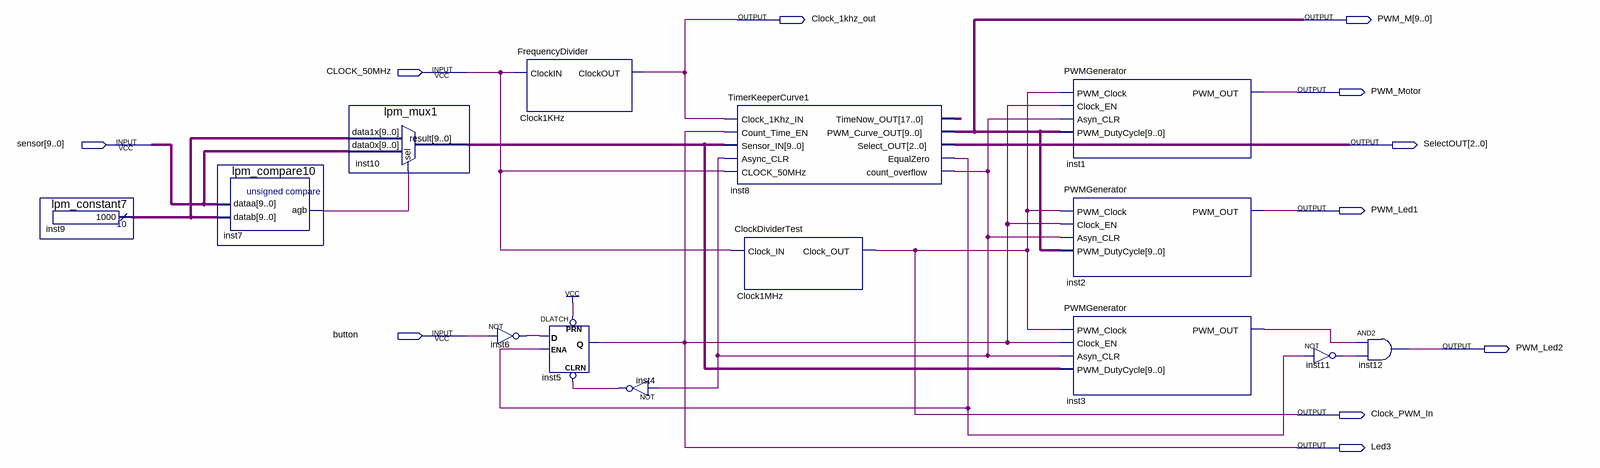
[diagram p0: schematic sheet]
// Quartus schematic MainDesign.bdf as structural Verilog: 14 symbols, 11 pins
module MainDesign (
  input  CLOCK_50MHz,
  input  [9:0] sensor,
  input  button,
  output Clock_1khz_out,
  output [9:0] PWM_M,
  output PWM_Motor,
  output [2:0] SelectOUT,
  output PWM_Led1,
  output PWM_Led2,
  output Clock_PWM_In,
  output Led3
);

  wire inst3_pwm_out, inst4_out, inst6_out, inst7_agb, inst8_count_overflow, inst8_equalzero, inst11_out;
  wire [9:0] inst9_result, inst10_result;
  wire [17:0] inst8_timenow_out;

  lpm_constant7 inst9 (.result(inst9_result));
  lpm_compare10 inst7 (.dataa(sensor), .datab(inst9_result), .agb(inst7_agb));
  lpm_mux1 inst10 (.data1x(inst9_result), .data0x(sensor), .sel(inst7_agb), .result(inst10_result));
  not inst6 (inst6_out, button);
  FrequencyDivider Clock1KHz (.ClockIN(CLOCK_50MHz), .ClockOUT(Clock_1khz_out));
  DLATCH inst5 (.CLRN(inst4_out), .D(inst6_out), .ENA(inst8_equalzero), .PRN(1'b1), .Q(Led3));
  not inst4 (inst4_out, inst8_count_overflow);
  TimerKeeperCurve1 inst8 (
    .Clock_1Khz_IN(Clock_1khz_out), .Count_Time_EN(Led3), .Sensor_IN(inst10_result),
    .Async_CLR(inst8_count_overflow), .CLOCK_50MHz(CLOCK_50MHz), .TimeNow_OUT(inst8_timenow_out),
    .PWM_Curve_OUT(PWM_M), .Select_OUT(SelectOUT), .EqualZero(inst8_equalzero),
    .count_overflow(inst8_count_overflow));
  ClockDividerTest Clock1MHz (.Clock_IN(CLOCK_50MHz), .Clock_OUT(Clock_PWM_In));
  PWMGenerator inst1 (
    .PWM_Clock(Clock_PWM_In), .Clock_EN(Led3), .Asyn_CLR(inst8_count_overflow), .PWM_DutyCycle(PWM_M),
    .PWM_OUT(PWM_Motor));
  PWMGenerator inst2 (
    .PWM_Clock(Clock_PWM_In), .Clock_EN(Led3), .Asyn_CLR(inst8_count_overflow), .PWM_DutyCycle(PWM_M),
    .PWM_OUT(PWM_Led1));
  PWMGenerator inst3 (
    .PWM_Clock(Clock_PWM_In), .Clock_EN(Led3), .Asyn_CLR(inst8_count_overflow),
    .PWM_DutyCycle(inst10_result), .PWM_OUT(inst3_pwm_out));
  not inst11 (inst11_out, inst8_equalzero);
  and inst12 (PWM_Led2, inst3_pwm_out, inst11_out);
endmodule
